# Altium schematic sheet USBserial.SchDoc
size A4
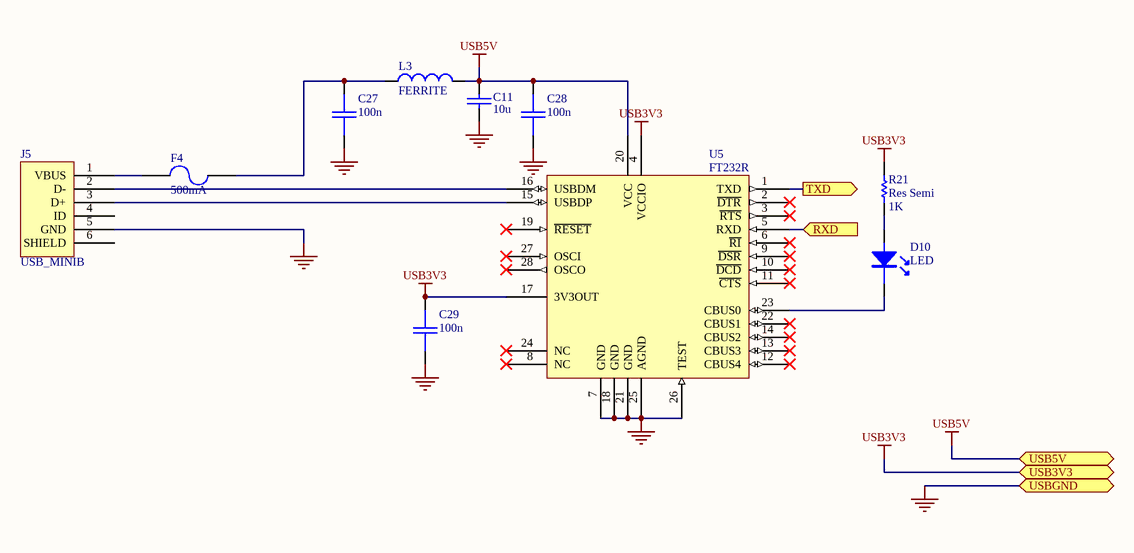
[diagram p0: USBserial.SchDoc]

## Parts
C11  10u  [0805]
C27  100n  [0603]
C28  100n  [0603]
C29  100n  [0603]
D10  LED  [3mmLED]
F4  500mA  [LITTELFUSE-154]
J5  USB_MINIB  [USB_MINIB]
L3  FERRITE  [0805]
R21  Res Semi  value 1K  [1608[0603]]
U5  FT232R  [SSOP28]

## Ports
RXD (in), TXD (out), USB3V3, USB5V, USBGND

## Nets
USB3V3: C29.1 R21.2 U5.4(VCCIO) U5.17(3V3OUT) ; port USB3V3
USB5V: C11.2 C28.1 L3.2 U5.20(VCC) ; port USB5V
USBGND: C11.1 C27.2 C28.2 C29.2 J5.5(GND) U5.7(GND) U5.18(GND) U5.21(GND) U5.25(AGND) U5.26(TEST) ; port USBGND
RXD: U5.5(RXD) ; port RXD
TXD: U5.1(TXD) ; port TXD
NetC27_1: C27.1 F4.2 L3.1
NetD10_A: D10.A R21.1
NetD10_K: D10.K U5.23(CBUS0)
NetF4_1: F4.1 J5.1(VBUS)
NetJ5_2: J5.2(D-) U5.16(USBDM)
NetJ5_3: J5.3(D+) U5.15(USBDP)

Not connected (* = marked no-connect by the designer): J5 4(ID) 6(SHIELD); U5 2(~{DTR})* 3(~{RTS})* 6(~{RI})* 8(NC)* 9(~{DSR})* 10(~{DCD})* 11(~{CTS})* 12(CBUS4)* 13(CBUS3)* 14(CBUS2)* 19(~{RESET})* 22(CBUS1)* 24(NC)* 27(OSCI)* 28(OSCO)*

## Library data of the parts
C11 C27-C29 = CAP: Capacitor
  C11: Element14: 1458902RL; Element14 Price: 0.69
  C27-C29: Element14: 9406140; Element14 Price: 0.13
F4 = FUSE2: Fuse; Element14 Price: 4.60 (min 10); Element14 (low stock): 9943625(holder+fuse); Digikey: F1301CT-ND(holder+fuse); Digikey Price: 3.96
J5 = USB_miniB_SMT: USB Mini B Connector; Element14: 9786473; Element14 Price: $3.08
L3 = INDUCTOR: Manufacturer: Generic Components; Revision: July-2002: Re-released for DXP Platform.; Element14: 1308773; Element14 Price: 0.72
R21 = Res Semi: Semiconductor Resistor; Element14: Stock
U5 = FT232R: USB UART IC; Element14: 1146032; Cost: 7.94
D10 = LED: Element14: 9739190; Element14 Price: 1.37